# EAGLE design hub_board (EAGLE 6.4)

## Sheet 1 of 6: Power
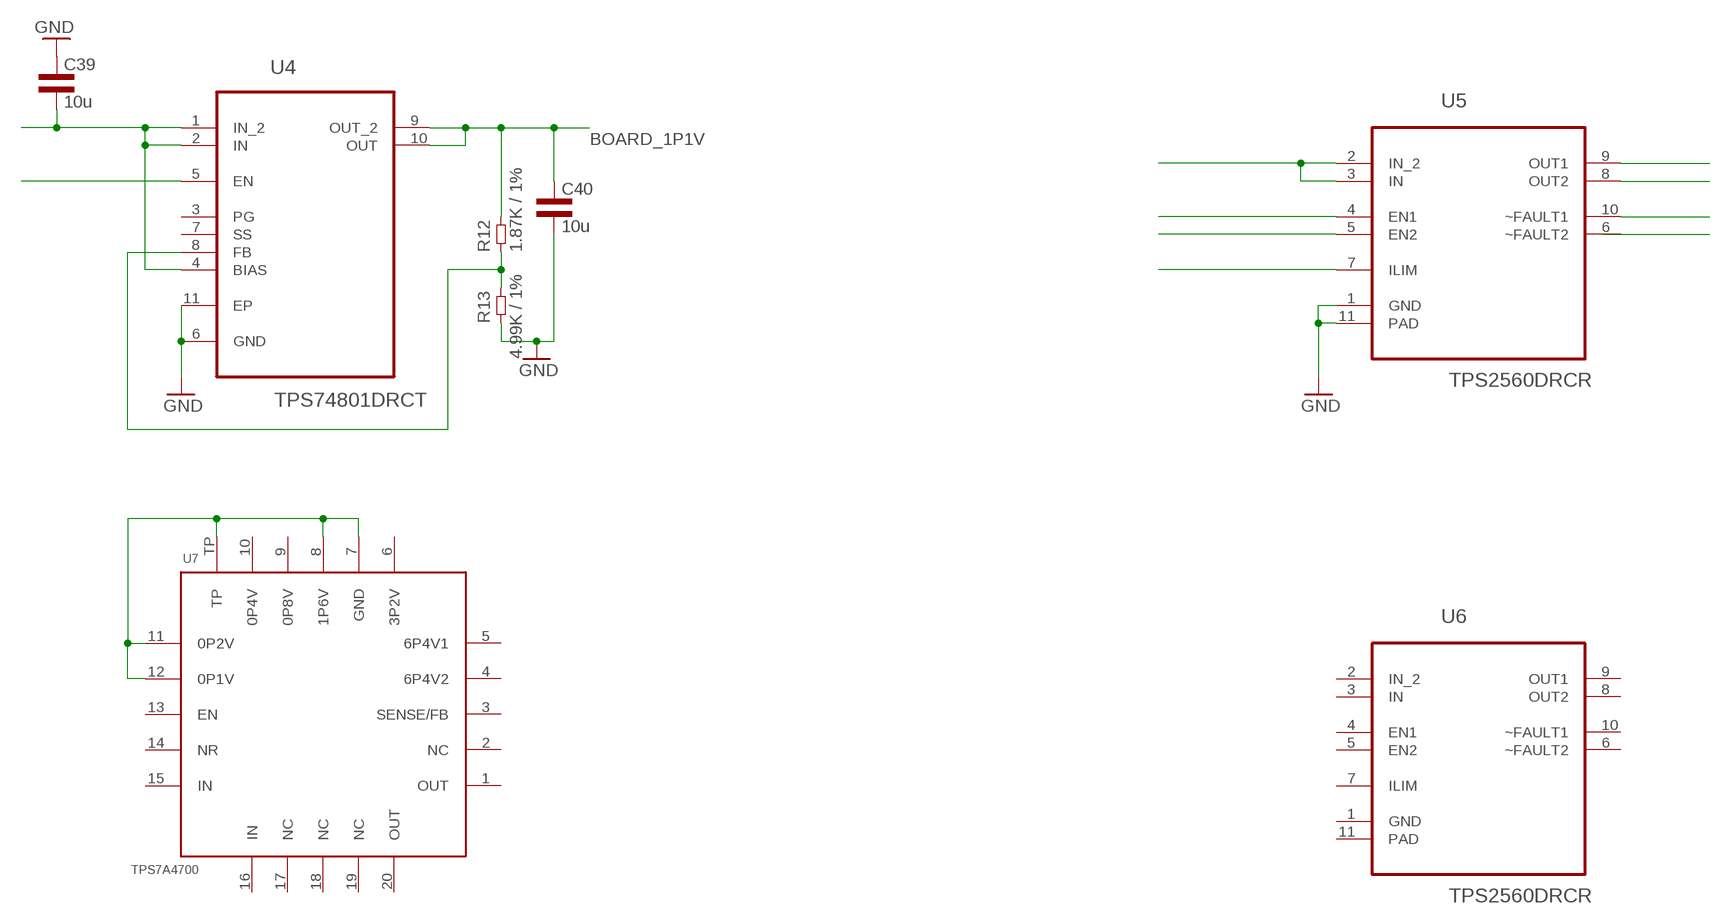
[diagram p0: schematic, sheet 1]

### Parts
C39  10u  CAP0805L3  [0805L3]
C40  10u  CAP0805L3  [0805L3]
R12  1.87K / 1%  RES0603L3  [0603L3]
R13  4.99K / 1%  RES0603L3  [0603L3]
U4  TPS74801DRCT  [SON50P300X300X100-11N]
U5  TPS2560DRCR  [SON50P300X300X100-11N]
U6  TPS2560DRCR  [SON50P300X300X100-11N]
U7  TPS7A4700  [VQFN-20]

### Nets
BOARD_1P1V: C40.1 R12.P$2 U4.9(OUT_2) U4.10(OUT)
GND: C39.1 C40.2 R13.P$1 U4.6(GND) U4.11(EP) U5.1(GND) U5.11(PAD) ; also sheet 2,4,6
N$2: C39.2 U4.1(IN_2) U4.2(IN) U4.4(BIAS)
N$3: U4.5(EN)
N$5: U5.2(IN_2) U5.3(IN)
N$6: U5.4(EN1)
N$8: R12.P$1 R13.P$2 U4.8(FB)
N$9: U5.5(EN2)
N$11: U5.7(ILIM)
N$15: U5.10(~FAULT1)
N$17: U5.9(OUT1)
N$18: U5.8(OUT2)
N$55: U7.7(GND) U7.8(1P6V) U7.11(0P2V) U7.12(0P1V) U7.TP
Unconnected: U4.3(PG) U4.7(SS) U5.6(~FAULT2) U6.1(GND) U6.4(EN1) U6.5(EN2) U6.6(~FAULT2) U6.7(ILIM) U6.8(OUT2) U6.9(OUT1) U6.10(~FAULT1) U6.11(PAD) U7.1(OUT) U7.2(NC) U7.3(SENSE/FB) U7.4(6P4V2) U7.5(6P4V1) U7.6(3P2V) U7.9(0P8V) U7.10(0P4V) U7.13(EN) U7.14(NR) U7.15(IN) U7.16(IN) U7.17(NC) U7.18(NC) U7.19(NC) U7.20(OUT)

## Sheet 2 of 6: 8040 Chip
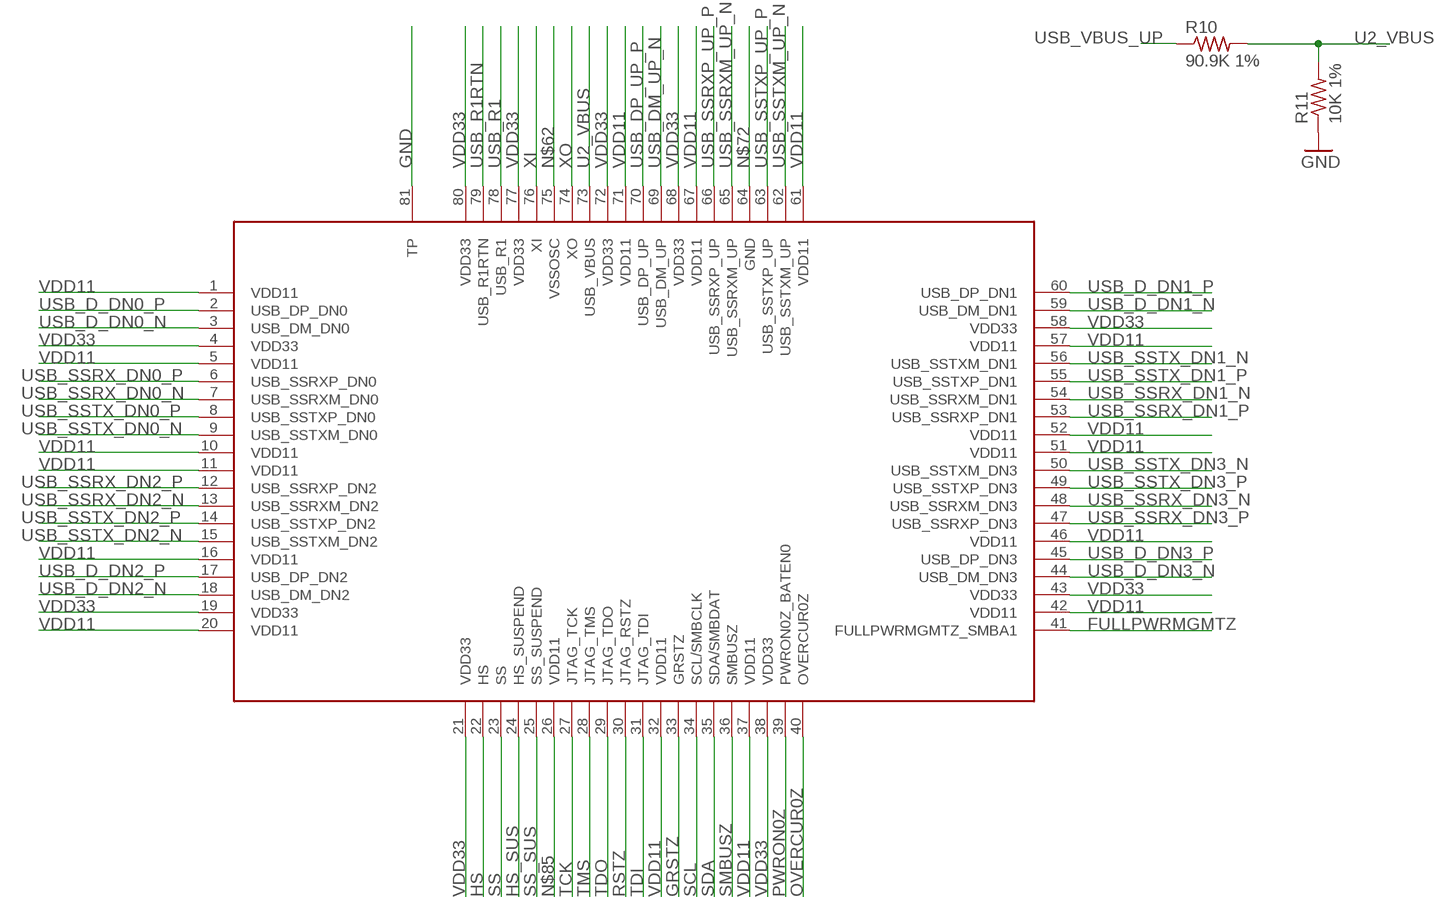
[diagram p1: schematic, sheet 2]

### Parts
R10  90.9K 1%  R-US_R0603  [R0603]
R11  10K 1%  R-US_R0603  [R0603]
U2  TUSB8040PFP  [S-PQFP-G80]

### Nets
FULLPWRMGMTZ: U2.41(FULLPWRMGMTZ_SMBA1)
GND: R11.1 U2.81(TP) ; also sheet 1,4,6
GRSTZ: U2.33(GRSTZ)
HS: U2.22(HS) ; also sheet 5
HS_SUS: U2.24(HS_SUSPEND) ; also sheet 5
N$62: U2.75(VSSOSC)
N$72: U2.64(GND)
N$85: U2.26(VDD11)
OVERCUR0Z: U2.40(OVERCUR0Z)
PWRON0Z: U2.39(PWRON0Z_BATEN0)
RSTZ: U2.30(JTAG_RSTZ)
SCL: U2.34(SCL/SMBCLK)
SDA: U2.35(SDA/SMBDAT)
SMBUSZ: U2.36(SMBUSZ)
SS: U2.23(SS) ; also sheet 5
SS_SUS: U2.25(SS_SUSPEND) ; also sheet 5
TCK: U2.27(JTAG_TCK)
TDI: U2.31(JTAG_TDI)
TDO: U2.29(JTAG_TDO)
TMS: U2.28(JTAG_TMS)
U2_VBUS: R10.2 R11.2 U2.73(USB_VBUS)
USB_D_DN0_N: U2.3(USB_DM_DN0) ; also sheet 4
USB_D_DN0_P: U2.2(USB_DP_DN0) ; also sheet 4
USB_D_DN1_N: U2.59(USB_DM_DN1) ; also sheet 4
USB_D_DN1_P: U2.60(USB_DP_DN1) ; also sheet 4
USB_D_DN2_N: U2.18(USB_DM_DN2) ; also sheet 4
USB_D_DN2_P: U2.17(USB_DP_DN2) ; also sheet 4
USB_D_DN3_N: U2.44(USB_DM_DN3) ; also sheet 4
USB_D_DN3_P: U2.45(USB_DP_DN3) ; also sheet 4
USB_DM_UP_N: U2.69(USB_DM_UP) ; also sheet 3
USB_DP_UP_P: U2.70(USB_DP_UP) ; also sheet 3
USB_R1: U2.78(USB_R1)
USB_R1RTN: U2.79(USB_R1RTN)
USB_SSRX_DN0_N: U2.7(USB_SSRXM_DN0) ; also sheet 4
USB_SSRX_DN0_P: U2.6(USB_SSRXP_DN0) ; also sheet 4
USB_SSRX_DN1_N: U2.54(USB_SSRXM_DN1) ; also sheet 4
USB_SSRX_DN1_P: U2.53(USB_SSRXP_DN1) ; also sheet 4
USB_SSRX_DN2_N: U2.13(USB_SSRXM_DN2) ; also sheet 4
USB_SSRX_DN2_P: U2.12(USB_SSRXP_DN2) ; also sheet 4
USB_SSRX_DN3_N: U2.48(USB_SSRXM_DN3) ; also sheet 4
USB_SSRX_DN3_P: U2.47(USB_SSRXP_DN3) ; also sheet 4
USB_SSRXM_UP_N: U2.65(USB_SSRXM_UP)
USB_SSRXP_UP_P: U2.66(USB_SSRXP_UP)
USB_SSTX_DN0_N: U2.9(USB_SSTXM_DN0) ; also sheet 4
USB_SSTX_DN0_P: U2.8(USB_SSTXP_DN0) ; also sheet 4
USB_SSTX_DN1_N: U2.56(USB_SSTXM_DN1) ; also sheet 4
USB_SSTX_DN1_P: U2.55(USB_SSTXP_DN1) ; also sheet 4
USB_SSTX_DN2_N: U2.15(USB_SSTXM_DN2) ; also sheet 4
USB_SSTX_DN2_P: U2.14(USB_SSTXP_DN2) ; also sheet 4
USB_SSTX_DN3_N: U2.50(USB_SSTXM_DN3) ; also sheet 4
USB_SSTX_DN3_P: U2.49(USB_SSTXP_DN3) ; also sheet 4
USB_SSTXM_UP_N: U2.62(USB_SSTXM_UP)
USB_SSTXP_UP_P: U2.63(USB_SSTXP_UP)
USB_VBUS_UP: R10.1
VDD11: U2.1(VDD11) U2.5(VDD11) U2.10(VDD11) U2.11(VDD11) U2.16(VDD11) U2.20(VDD11) U2.32(VDD11) U2.37(VDD11) U2.42(VDD11) U2.46(VDD11) U2.51(VDD11) U2.52(VDD11) U2.57(VDD11) U2.61(VDD11) U2.67(VDD11) U2.71(VDD11) ; also sheet 6
VDD33: U2.4(VDD33) U2.19(VDD33) U2.21(VDD33) U2.38(VDD33) U2.43(VDD33) U2.58(VDD33) U2.68(VDD33) U2.72(VDD33) U2.77(VDD33) U2.80(VDD33) ; also sheet 6
XI: U2.76(XI)
XO: U2.74(XO)

## Sheet 3 of 6: Upstream Port
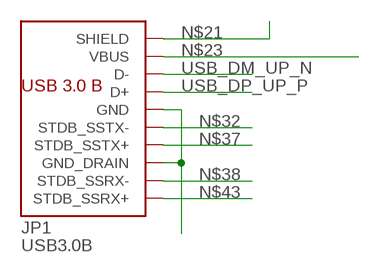
[diagram p2: schematic, sheet 3]

### Parts
JP1  USB3.0B  [AMPHENOLUSB3.0B]

### Nets
N$21: JP1.10@1(SHIELD) JP1.10@2(SHIELD)
N$23: JP1.1(VBUS)
N$24: JP1.4(GND) JP1.7(GND_DRAIN)
N$32: JP1.5(STDB_SSTX-)
N$37: JP1.6(STDB_SSTX+)
N$38: JP1.8(STDB_SSRX-)
N$43: JP1.9(STDB_SSRX+)
USB_DM_UP_N: JP1.2(D-) ; also sheet 2
USB_DP_UP_P: JP1.3(D+) ; also sheet 2

## Sheet 4 of 6: USB Ports
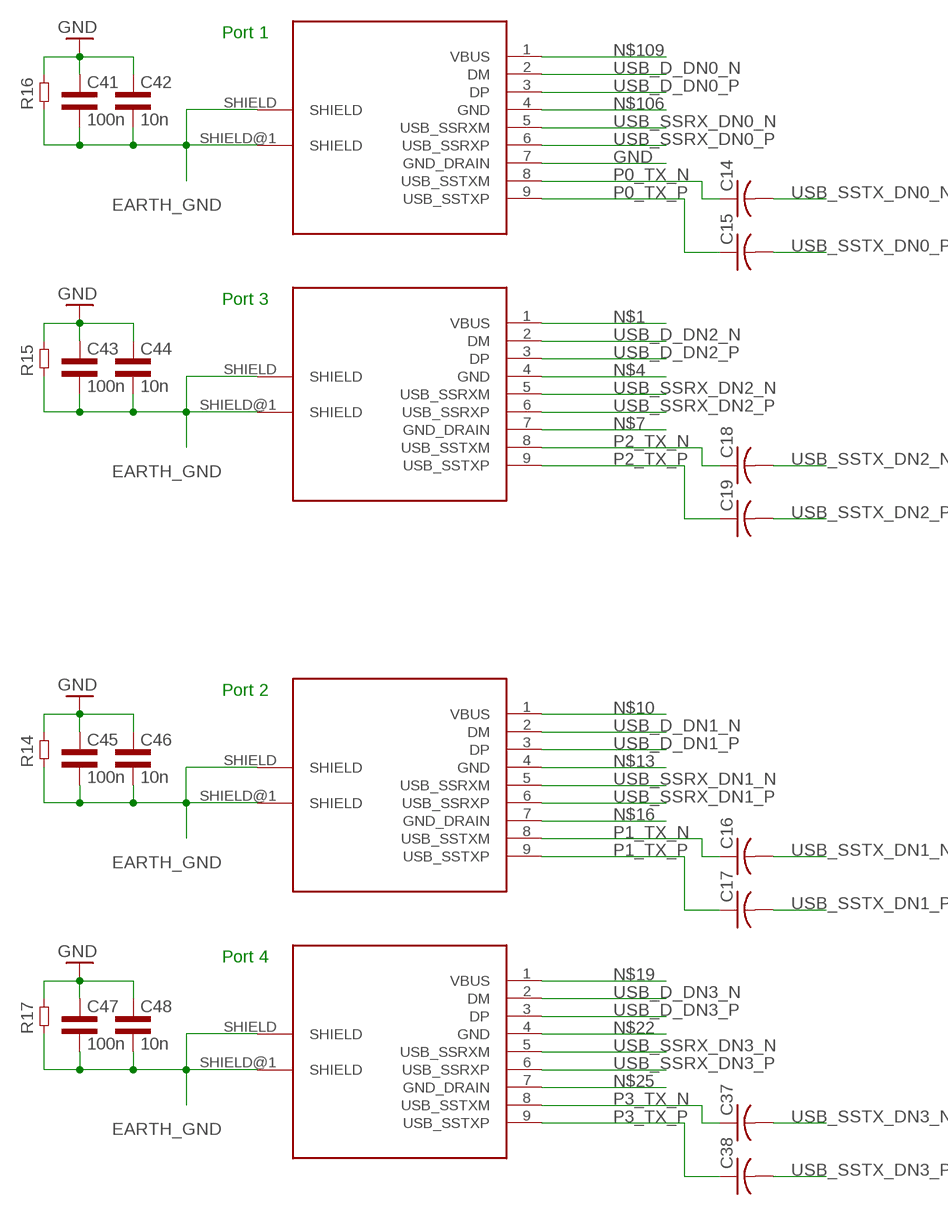
[diagram p3: schematic, sheet 4]

### Parts
C14  C-USC0201  [C0201]
C15  C-USC0201  [C0201]
C16  C-USC0201  [C0201]
C17  C-USC0201  [C0201]
C18  C-USC0201  [C0201]
C19  C-USC0201  [C0201]
C37  C-USC0201  [C0201]
C38  C-USC0201  [C0201]
C41  100n  CAP0603L3  [0603L3]
C42  10n  CAP0603L3  [0603L3]
C43  100n  CAP0603L3  [0603L3]
C44  10n  CAP0603L3  [0603L3]
C45  100n  CAP0603L3  [0603L3]
C46  10n  CAP0603L3  [0603L3]
C47  100n  CAP0603L3  [0603L3]
C48  10n  CAP0603L3  [0603L3]
R14  RES0603L3  [0603L3]
R15  RES0603L3  [0603L3]
R16  RES0603L3  [0603L3]
R17  RES0603L3  [0603L3]
U$1  USB_SS_CONN_TYPE_A  [R_A_DIP]
U$3  USB_SS_CONN_TYPE_A  [R_A_DIP]
U$4  USB_SS_CONN_TYPE_A  [R_A_DIP]
U$5  USB_SS_CONN_TYPE_A  [R_A_DIP]

### Nets
EARTH_GND: C41.P$2 C42.P$2 C43.P$2 C44.P$2 C45.P$2 C46.P$2 C47.P$2 C48.P$2 R14.P$1 R15.P$1 R16.P$1 R17.P$1 U$1.SHIELD U$1.SHIELD@1(SHIELD) U$3.SHIELD U$3.SHIELD@1(SHIELD) U$4.SHIELD U$4.SHIELD@1(SHIELD) U$5.SHIELD U$5.SHIELD@1(SHIELD)
GND: C41.P$1 C42.P$1 C43.P$1 C44.P$1 C45.P$1 C46.P$1 C47.P$1 C48.P$1 R14.P$2 R15.P$2 R16.P$2 R17.P$2 U$1.7(GND_DRAIN) ; also sheet 1,2,6
N$1: U$3.1(VBUS)
N$4: U$3.4(GND)
N$7: U$3.7(GND_DRAIN)
N$10: U$4.1(VBUS)
N$13: U$4.4(GND)
N$16: U$4.7(GND_DRAIN)
N$19: U$5.1(VBUS)
N$22: U$5.4(GND)
N$25: U$5.7(GND_DRAIN)
N$106: U$1.4(GND)
N$109: U$1.1(VBUS)
P0_TX_N: C14.1 U$1.8(USB_SSTXM)
P0_TX_P: C15.1 U$1.9(USB_SSTXP)
P1_TX_N: C16.1 U$4.8(USB_SSTXM)
P1_TX_P: C17.1 U$4.9(USB_SSTXP)
P2_TX_N: C18.1 U$3.8(USB_SSTXM)
P2_TX_P: C19.1 U$3.9(USB_SSTXP)
P3_TX_N: C37.1 U$5.8(USB_SSTXM)
P3_TX_P: C38.1 U$5.9(USB_SSTXP)
USB_D_DN0_N: U$1.2(DM) ; also sheet 2
USB_D_DN0_P: U$1.3(DP) ; also sheet 2
USB_D_DN1_N: U$4.2(DM) ; also sheet 2
USB_D_DN1_P: U$4.3(DP) ; also sheet 2
USB_D_DN2_N: U$3.2(DM) ; also sheet 2
USB_D_DN2_P: U$3.3(DP) ; also sheet 2
USB_D_DN3_N: U$5.2(DM) ; also sheet 2
USB_D_DN3_P: U$5.3(DP) ; also sheet 2
USB_SSRX_DN0_N: U$1.5(USB_SSRXM) ; also sheet 2
USB_SSRX_DN0_P: U$1.6(USB_SSRXP) ; also sheet 2
USB_SSRX_DN1_N: U$4.5(USB_SSRXM) ; also sheet 2
USB_SSRX_DN1_P: U$4.6(USB_SSRXP) ; also sheet 2
USB_SSRX_DN2_N: U$3.5(USB_SSRXM) ; also sheet 2
USB_SSRX_DN2_P: U$3.6(USB_SSRXP) ; also sheet 2
USB_SSRX_DN3_N: U$5.5(USB_SSRXM) ; also sheet 2
USB_SSRX_DN3_P: U$5.6(USB_SSRXP) ; also sheet 2
USB_SSTX_DN0_N: C14.2 ; also sheet 2
USB_SSTX_DN0_P: C15.2 ; also sheet 2
USB_SSTX_DN1_N: C16.2 ; also sheet 2
USB_SSTX_DN1_P: C17.2 ; also sheet 2
USB_SSTX_DN2_N: C18.2 ; also sheet 2
USB_SSTX_DN2_P: C19.2 ; also sheet 2
USB_SSTX_DN3_N: C37.2 ; also sheet 2
USB_SSTX_DN3_P: C38.2 ; also sheet 2

### Notes on the sheet
- Port 1
- Port 3
- Port 2
- Port 4

## Sheet 5 of 6: Indicators
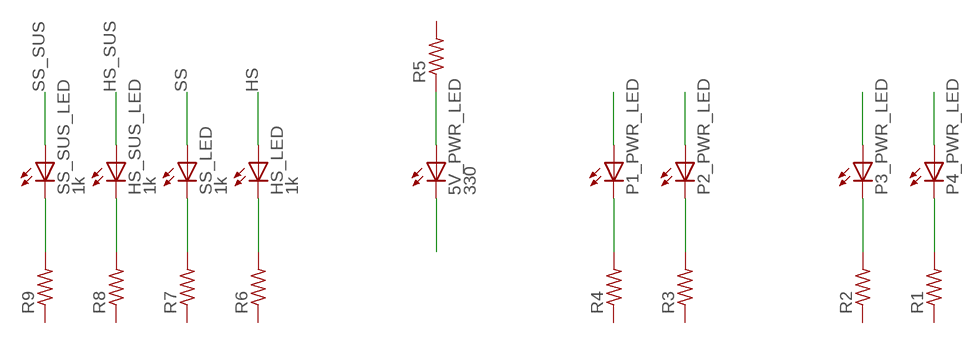
[diagram p4: schematic, sheet 5]

### Parts
5V_PWR_LED  330  LEDCHIP-LED0603  [CHIP-LED0603]
HS_LED  1k  LEDCHIP-LED0603  [CHIP-LED0603]
HS_SUS_LED  1k  LEDCHIP-LED0603  [CHIP-LED0603]
P1_PWR_LED  LEDCHIP-LED0603  [CHIP-LED0603]
P2_PWR_LED  LEDCHIP-LED0603  [CHIP-LED0603]
P3_PWR_LED  LEDCHIP-LED0603  [CHIP-LED0603]
P4_PWR_LED  LEDCHIP-LED0603  [CHIP-LED0603]
R1  R-US_R0603  [R0603]
R2  R-US_R0603  [R0603]
R3  R-US_R0603  [R0603]
R4  R-US_R0603  [R0603]
R5  R-US_R0603  [R0603]
R6  R-US_R0603  [R0603]
R7  R-US_R0603  [R0603]
R8  R-US_R0603  [R0603]
R9  R-US_R0603  [R0603]
SS_LED  1k  LEDCHIP-LED0603  [CHIP-LED0603]
SS_SUS_LED  1k  LEDCHIP-LED0603  [CHIP-LED0603]

### Nets
HS: HS_LED.A ; also sheet 2
HS_SUS: HS_SUS_LED.A ; also sheet 2
N$33: 5V_PWR_LED.A R5.1
N$34: P1_PWR_LED.A
N$35: P2_PWR_LED.A
N$36: P3_PWR_LED.A
N$39: P4_PWR_LED.A
N$40: P4_PWR_LED.C R1.2
N$41: P3_PWR_LED.C R2.2
N$42: P2_PWR_LED.C R3.2
N$46: 5V_PWR_LED.C
N$47: HS_LED.C R6.2
N$48: R7.2 SS_LED.C
N$50: HS_SUS_LED.C R8.2
N$51: R9.2 SS_SUS_LED.C
N$100: P1_PWR_LED.C R4.2
SS: SS_LED.A ; also sheet 2
SS_SUS: SS_SUS_LED.A ; also sheet 2
Unconnected: R1.1 R2.1 R3.1 R4.1 R5.2 R6.1 R7.1 R8.1 R9.1

## Sheet 6 of 6: Bypass Caps
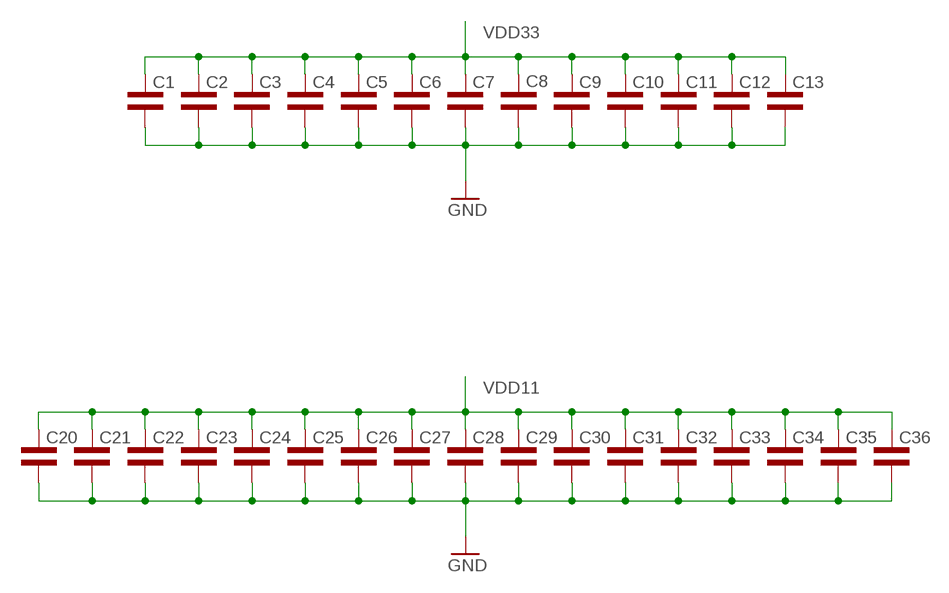
[diagram p5: schematic, sheet 6]

### Parts
C1  CAP0402L3  [0402L3]
C2  CAP0402L3  [0402L3]
C3  CAP0402L3  [0402L3]
C4  CAP0402L3  [0402L3]
C5  CAP0402L3  [0402L3]
C6  CAP0402L3  [0402L3]
C7  CAP0402L3  [0402L3]
C8  CAP0402L3  [0402L3]
C9  CAP0402L3  [0402L3]
C10  CAP0402L3  [0402L3]
C11  CAP0402L3  [0402L3]
C12  CAP0402L3  [0402L3]
C13  CAP0402L3  [0402L3]
C20  CAP0402L3  [0402L3]
C21  CAP0402L3  [0402L3]
C22  CAP0402L3  [0402L3]
C23  CAP0402L3  [0402L3]
C24  CAP0402L3  [0402L3]
C25  CAP0402L3  [0402L3]
C26  CAP0402L3  [0402L3]
C27  CAP0402L3  [0402L3]
C28  CAP0402L3  [0402L3]
C29  CAP0402L3  [0402L3]
C30  CAP0402L3  [0402L3]
C31  CAP0402L3  [0402L3]
C32  CAP0402L3  [0402L3]
C33  CAP0402L3  [0402L3]
C34  CAP0402L3  [0402L3]
C35  CAP0402L3  [0402L3]
C36  CAP0402L3  [0402L3]

### Nets
GND: C1.P$2 C2.P$2 C3.P$2 C4.P$2 C5.P$2 C6.P$2 C7.P$2 C8.P$2 C9.P$2 C10.P$2 C11.P$2 C12.P$2 C13.P$2 C20.P$2 C21.P$2 C22.P$2 C23.P$2 C24.P$2 C25.P$2 C26.P$2 C27.P$2 C28.P$2 C29.P$2 C30.P$2 C31.P$2 C32.P$2 C33.P$2 C34.P$2 C35.P$2 C36.P$2 ; also sheet 1,2,4
VDD11: C20.P$1 C21.P$1 C22.P$1 C23.P$1 C24.P$1 C25.P$1 C26.P$1 C27.P$1 C28.P$1 C29.P$1 C30.P$1 C31.P$1 C32.P$1 C33.P$1 C34.P$1 C35.P$1 C36.P$1 ; also sheet 2
VDD33: C1.P$1 C2.P$1 C3.P$1 C4.P$1 C5.P$1 C6.P$1 C7.P$1 C8.P$1 C9.P$1 C10.P$1 C11.P$1 C12.P$1 C13.P$1 ; also sheet 2

## Power pins joined to a net without a drawn wire
IN: U6.3(IN)
IN_2: U6.2(IN_2)

## Library data of the parts
5V_PWR_LED HS_LED HS_SUS_LED P1_PWR_LED P2_PWR_LED P3_PWR_LED P4_PWR_LED SS_LED SS_SUS_LED = adafruit:LED: LED OSRAM: - CHIPLED LG R971, LG N971, LY N971, LG Q971, LY Q971, LO R971, LY R971 LH N974, LH R974 LS Q976, LO Q976, LY Q976 LO Q996 - Hyper CHIPLED LW Q18S LB Q993, LB Q99A, LB R99A - SideLED LS A670, LO A670, LY A670, LG A670, LP A670 LB A673, LV A673, LT A673, LW A673 LH A674 LY A675 LS A676, LA A676, LO A676, LY A676, LW A676 LS A679, LY A679, LG A679 - Hyper Micro SIDELED® LS Y876, LA Y876, LO Y876, LY Y876 LT Y87S - SmartLED LW L88C, LW L88S LB L89C, LB L89S, LG L890 LS L89K, LO L89K, LY L89K LS L896, LA L896, LO L896, LY L896 - TOPLED LS T670, LO T670, LY T670, LG T670, LP T670 LSG T670, LSP T670, LSY T670, LOP T670, LYG T670 LG T671, LOG T671, LSG T671 LB T673, LV T673, LT T673, LW T673 LH T674 LS T676, LA T676, LO T676, LY T676, LB T676, LH T676, LSB T676, LW T676 LB T67C, LV T67C, LT T67C, LS T67K, LO T67K, LY T67K, LW E67C LS E67B, LA E67B, LO E67B, LY E67B, LB E67C, LV E67C, LT E67C LW T67C LS T679, LY T679, LG T679 LS T770, LO T770, LY T770, LG T770, LP T770 LB T773, LV T773, LT T773, LW T773 LH T774 LS E675, LA E675, LY E675, LS T675 LS T776, LA T776, LO T776, LY T776, LB T776 LHGB T686 LT T68C, LB T68C - Hyper Mini TOPLED® LB M676 - Mini TOPLED Santana® LG M470 LS M47K, LO M47K, LY M47K Source: http://www.osram.convergy.de/
C1-C13 C20-C36 C39-C48 = common:CAP
C14-C19 C37 C38 = rcl:C-US: CAPACITOR, American symbol
JP1 = AlexW-Eagle-Libraries:USB3.0B: USB3.0B Amphenol USB 3.0 B connector
R1-R11 = rcl:R-US_: RESISTOR, American symbol
R12-R17 = common:RES
U2 = tusb8040a1:TUSB8040PFP: TUSB8040 is a 4-port SuperSPeed USB 3.0 hub.
U4 = Texas Instruments_By_element14_Batch_1:TPS74801DRCT: Linear Regulator with Programmable Soft-Start; MPN: TPS74801DRCT; OC_FARNELL: 1755498; OC_NEWARK: 30M1869; PACKAGE: SON-10; SUPPLIER: TEXAS INSTRUMENTS
U5 U6 = Texas Instruments_By_element14_Batch_1:TPS2560DRCR: DUAL CHANNEL PRECISION ADJUSTABLE CURRENT-LIMITED POWER SWITCHES; MPN: TPS2560DRCR; OC_FARNELL: -; OC_NEWARK: 64R0736; PACKAGE: SON-10; SUPPLIER: TEXAS INSTRUMENTS
U7 = ti_ldo:TPS7A4700: Ultra-Low Noise POSITIVE Voltage Regulator
U$1 U$3-U$5 = usb3_type_a:USB_SS_CONN_TYPE_A: USB 3 SuperSpeed Type A connector, through hole design.

## Board
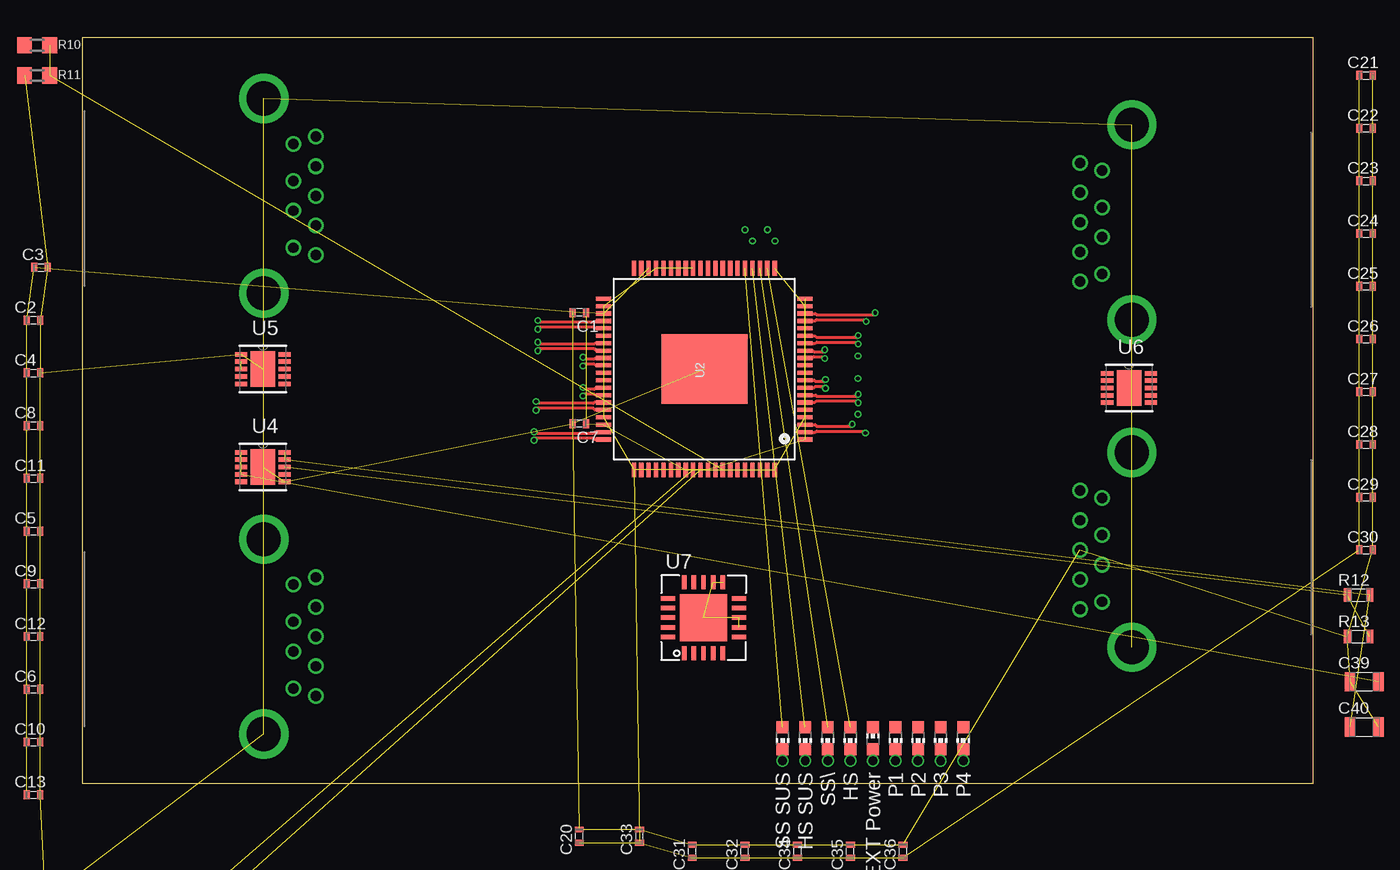
[diagram p6: board, top side]
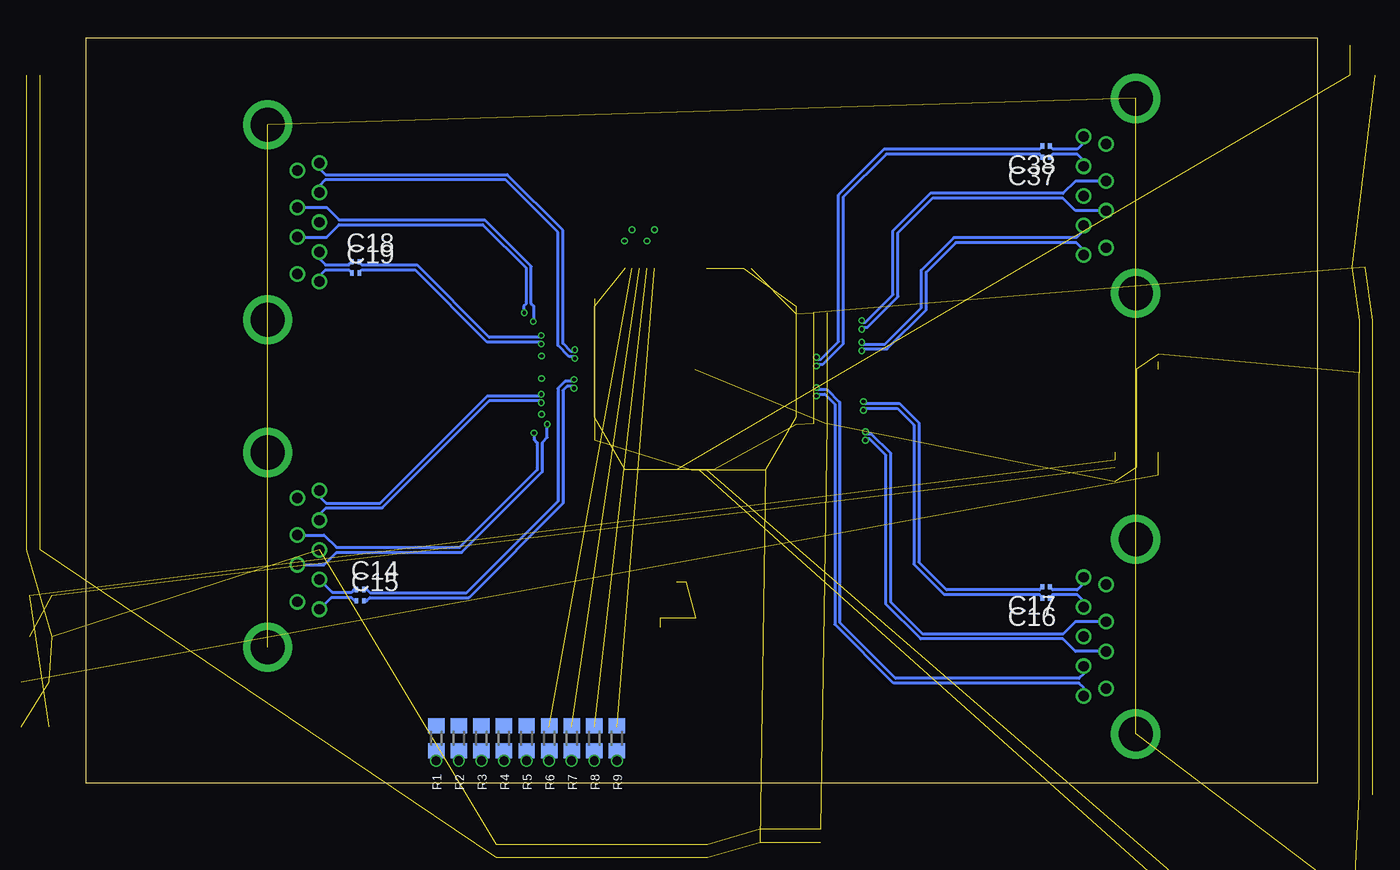
[diagram p7: board, bottom side, seen from below]

Size 83.04 x 50.29 mm. Coordinates in mm from the lower left corner, seen from the top.
Outline: 0,0 83.04,0 83.04,50.29 0,50.29 0,0
Copper layers (1*2*3*16): Top 0.035mm / dielectric 1.5mm / Route2 0.035mm / dielectric 0.15mm / Route3 0.035mm / dielectric 0.2mm / Bottom 0.035mm
Design rules "default *": minimum track width 5mil, minimum drill 10mil, track to track 5mil, track to pad 5mil, pad to pad 5mil, via to via 5mil, smd to smd 5mil, copper to edge 13mil, drill to drill 8mil, minimum pad ring 4mil, minimum via ring 4mil, stop-mask expansion 2mil, vias tented up to drill 0mil, thermal gap 10mil

### Footprints (pad centres in the part's own frame; a part is rotated, then mirrored left to right if it is on the bottom)
CHIP-LED0603 = smd 0.8 x 0.8: A 0,-0.75; C 0,0.75
0402L3 = smd 0.4 x 0.6: P$1 -0.45,0; P$2 0.45,0
C0201 = smd 0.25 x 0.35: 1 -0.25,0; 2 0.25,0
0805L3 = smd 0.7 x 1.3: 1 -0.95,0; 2 0.95,0
0603L3 = smd 0.5 x 0.9: P$1 -0.75,0; P$2 0.75,0
AMPHENOLUSB3.0B = drill 0.92 square: 1 1.25,4.71; 2 -1.25,4.71; 3 -1.25,2.71; 4 1.25,2.71 | drill 0.7 square: 5 -4.5,6.71; 6 -2.75,6.71; 7 0,6.71; 8 2.75,6.71; 9 4.5,6.71 | drill 2.3 square: 10@1 -6.02,0; 10@2 6.02,0
R0603 = smd 1 x 1.1: 1 -0.85,0; 2 0.85,0
S-PQFP-G80 = smd 0.28 x 1: 1 -4.75,-6.8; 2 -4.25,-6.8; 3 -3.75,-6.8; 4 -3.25,-6.8; 5 -2.75,-6.8; 6 -2.25,-6.8; 7 -1.75,-6.8; 8 -1.25,-6.8; 9 -0.75,-6.8; 10 -0.25,-6.8; 11 0.25,-6.8; 12 0.75,-6.8; 13 1.25,-6.8; 14 1.75,-6.8; 15 2.25,-6.8; 16 2.75,-6.8; 17 3.25,-6.8; 18 3.75,-6.8; 19 4.25,-6.8; 20 4.75,-6.8; 41 4.75,6.8; 42 4.25,6.8; 43 3.75,6.8; 44 3.25,6.8; 45 2.75,6.8; 46 2.25,6.8; 47 1.75,6.8; 48 1.25,6.8; 49 0.75,6.8; 50 0.25,6.8; 51 -0.25,6.8; 52 -0.75,6.8; 53 -1.25,6.8; 54 -1.75,6.8; 55 -2.25,6.8; 56 -2.75,6.8; 57 -3.25,6.8; 58 -3.75,6.8; 59 -4.25,6.8; 60 -4.75,6.8 | smd 1 x 0.28: 21 6.8,-4.75; 22 6.8,-4.25; 23 6.8,-3.75; 24 6.8,-3.25; 25 6.8,-2.75; 26 6.8,-2.25; 27 6.8,-1.75; 28 6.8,-1.25; 29 6.8,-0.75; 30 6.8,-0.25; 31 6.8,0.25; 32 6.8,0.75; 33 6.8,1.25; 34 6.8,1.75; 35 6.8,2.25; 36 6.8,2.75; 37 6.8,3.25; 38 6.8,3.75; 39 6.8,4.25; 40 6.8,4.75; 61 -6.8,4.75; 62 -6.8,4.25; 63 -6.8,3.75; 64 -6.8,3.25; 65 -6.8,2.75; 66 -6.8,2.25; 67 -6.8,1.75; 68 -6.8,1.25; 69 -6.8,0.75; 70 -6.8,0.25; 71 -6.8,-0.25; 72 -6.8,-0.75; 73 -6.8,-1.25; 74 -6.8,-1.75; 75 -6.8,-2.25; 76 -6.8,-2.75; 77 -6.8,-3.25; 78 -6.8,-3.75; 79 -6.8,-4.25; 80 -6.8,-4.75 | smd 4.7 x 5.8: 81 0,0
SON50P300X300X100-11N = smd 0.813 x 0.305: 1 -1.473,0.991; 2 -1.473,0.508; 3 -1.473,0; 4 -1.473,-0.508; 5 -1.473,-0.991; 6 1.473,-0.991; 7 1.473,-0.508; 8 1.473,0; 9 1.473,0.508; 10 1.473,0.991 | smd 1.651 x 2.388: 11 0,0
VQFN-20 = smd 0.3 x 0.95: 1 -1.3,-2.4; 2 -0.65,-2.4; 3 0,-2.4; 4 0.65,-2.4; 5 1.3,-2.4; 11 1.3,2.4; 12 0.65,2.4; 13 0,2.4; 14 -0.65,2.4; 15 -1.3,2.4 | smd 0.95 x 0.3: 6 2.4,-1.3; 7 2.4,-0.65; 8 2.4,0; 9 2.4,0.65; 10 2.4,1.3; 16 -2.4,1.3; 17 -2.4,0.65; 18 -2.4,0; 19 -2.4,-0.65; 20 -2.4,-1.3 | smd 3.15 x 3.15: TP 0,0
R_A_DIP = drill 0.7: 1 -1.5,3.5; 2 -1.5,1; 3 -1.5,-1; 4 -1.5,-3.5; 5 0,-4; 6 0,-2; 7 0,0; 8 0,2; 9 0,4 | drill 2.3: SHIELD -3.5,6.57; SHIELD@1 -3.5,-6.57

### Placement (x,y rotation side)
5V_PWR_LED  53.34,3.05 0 top
C1  33.53,31.75 180 top
C2  -3.3,31.24 0 top
C3  -2.79,34.8 0 top
C4  -3.3,27.69 0 top
C5  -3.3,17.02 0 top
C6  -3.3,6.35 0 top
C7  33.53,24.26 180 top
C8  -3.3,24.13 0 top
C9  -3.3,13.46 0 top
C10  -3.3,2.79 0 top
C11  -3.3,20.57 0 top
C12  -3.3,9.91 0 top
C13  -3.3,-0.76 0 top
C14  64.57,13.08 0 bottom
C15  64.57,12.32 0 bottom
C16  18.29,12.51 180 bottom
C17  18.29,13.27 180 bottom
C18  64.87,35.18 0 bottom
C19  64.87,34.42 0 bottom
C20  33.53,-3.56 90 top  (outside the outline)
C21  86.61,47.75 0 top  (outside the outline)
C22  86.61,44.2 0 top  (outside the outline)
C23  86.61,40.64 0 top  (outside the outline)
C24  86.61,37.08 0 top  (outside the outline)
C25  86.61,33.53 0 top  (outside the outline)
C26  86.61,29.97 0 top  (outside the outline)
C27  86.61,26.42 0 top  (outside the outline)
C28  86.61,22.86 0 top  (outside the outline)
C29  86.61,19.3 0 top  (outside the outline)
C30  86.61,15.75 0 top  (outside the outline)
C31  41.15,-4.57 90 top  (outside the outline)
C32  44.7,-4.57 90 top  (outside the outline)
C33  37.59,-3.56 90 top  (outside the outline)
C34  48.26,-4.57 90 top  (outside the outline)
C35  51.82,-4.57 90 top  (outside the outline)
C36  55.37,-4.57 90 top  (outside the outline)
C37  18.29,42.23 180 bottom
C38  18.29,42.99 180 bottom
C39  86.49,6.86 0 top
C40  86.49,3.81 0 top
C41  -3.17,-20.07 0 top  (outside the outline)
C42  -3.17,-22.86 0 top  (outside the outline)
C43  -3.17,-25.65 0 top  (outside the outline)
C44  -3.17,-28.45 0 top  (outside the outline)
C45  -3.17,-31.24 0 top  (outside the outline)
C46  -3.17,-34.04 0 top  (outside the outline)
C47  -3.17,-36.83 0 top  (outside the outline)
C48  -3.17,-39.62 0 top  (outside the outline)
HS_LED  51.82,3.05 180 top
HS_SUS_LED  48.77,3.05 180 top
JP1  -12.95,-31.5 0 top  (outside the outline)
P1_PWR_LED  54.86,3.05 180 top
P2_PWR_LED  56.39,3.05 180 top
P3_PWR_LED  57.91,3.05 180 top
P4_PWR_LED  59.44,3.05 180 top
R1  59.44,3.05 270 bottom
R2  57.91,3.05 270 bottom
R3  56.39,3.05 270 bottom
R4  54.86,3.05 270 bottom
R5  53.34,3.05 90 bottom
R6  51.82,3.05 270 bottom
R7  50.29,3.05 270 bottom
R8  48.77,3.05 270 bottom
R9  47.24,3.05 270 bottom
R10  -3.05,49.78 0 top
R11  -3.05,47.75 0 top
R12  86.11,12.7 0 top
R13  86.11,9.91 0 top
R14  -3.17,-8.89 0 top  (outside the outline)
R15  -3.17,-11.68 0 top  (outside the outline)
R16  -3.17,-14.48 0 top  (outside the outline)
R17  -3.17,-17.27 0 top  (outside the outline)
SS_LED  50.29,3.05 180 top
SS_SUS_LED  47.24,3.05 180 top
U2  41.96,27.94 90 top
U4  12.19,21.34 0 top
U5  12.19,27.94 0 top
U6  70.61,26.67 0 top
U7  41.91,11.18 0 top
U$1  67.31,15.75 180 top
U$3  67.31,37.85 180 top
U$4  15.75,9.91 0 top
U$5  15.75,39.62 0 top

### Tracks (layer width: path | path; a pad name or v marks a point on that pad's centre or on a via)
BOARD_1P1V  (3 unrouted)
EARTH_GND  (19 unrouted)
GND  (51 unrouted)
HS  (1 unrouted)
HS_SUS  (1 unrouted)
N$2  (3 unrouted)
N$5  (1 unrouted)
N$8  (2 unrouted)
N$12  (via drill 0.25)
  other vias: 52.32,28.83
N$14  (via drill 0.25)
  other vias: 52.32,24.89
N$20  (via drill 0.25)
  other vias: 52.32,27.3
N$21  (1 unrouted)
N$24  (1 unrouted)
N$28  (via drill 0.25)
  other vias: 46.74,36.58
N$29  (via drill 0.25)
  other vias: 46.23,37.34
N$30  (via drill 0.25)
  other vias: 45.21,36.58
N$31  (via drill 0.25)
  other vias: 44.7,37.34
N$33  (via drill 0.6)
  Top 0.406: 5V_PWR_LED.A v53.34,1.52
  Bottom 0.406: R5.1 v53.34,1.52
N$40  (via drill 0.6)
  Top 0.406: P4_PWR_LED.C v59.44,1.52
  Bottom 0.406: R1.2 v59.44,1.52
N$41  (via drill 0.6)
  Top 0.406: P3_PWR_LED.C v57.91,1.52
  Bottom 0.406: R2.2 v57.91,1.52
N$42  (via drill 0.6)
  Top 0.406: P2_PWR_LED.C v56.39,1.52
  Bottom 0.406: R3.2 v56.39,1.52
N$47  (via drill 0.6)
  Top 0.406: HS_LED.C v51.82,1.52
  Bottom 0.406: R6.2 v51.82,1.52
N$48  (via drill 0.6)
  Top 0.406: SS_LED.C v50.29,1.52
  Bottom 0.406: R7.2 v50.29,1.52
N$50  (via drill 0.6)
  Top 0.406: HS_SUS_LED.C v48.77,1.52
  Bottom 0.406: R8.2 v48.77,1.52
N$51  (via drill 0.6)
  Top 0.406: SS_SUS_LED.C v47.24,1.52
  Bottom 0.406: R9.2 v47.24,1.52
N$55  (4 unrouted)
N$100  (via drill 0.6)
  Top 0.406: P1_PWR_LED.C v54.86,1.52
  Bottom 0.406: R4.2 v54.86,1.52
P0_TX_N
  Bottom 0.203: C14.1 64.94,13.08 65.15,12.86 66.43,12.86 U$1.8
P0_TX_P
  Bottom 0.203: C15.1 64.94,12.32 65.15,12.53 66.52,12.53 U$1.9
P1_TX_N
  Bottom 0.203: C16.1 18.04,12.53 17.84,12.72 16.19,12.72 15.75,12.28 U$4.8
P1_TX_P
  Bottom 0.203: C17.1 18.04,13.25 17.84,13.06 16.19,13.06 15.75,13.5 U$4.9
P2_TX_N
  Bottom 0.203: U$3.8 67.31,35.37 66.9,34.96 65.34,34.96 C18.1
P2_TX_P
  Bottom 0.203: U$3.9 67.31,34.23 66.9,34.63 65.34,34.63 C19.1
P3_TX_N
  Bottom 0.203: C37.1 18.04,42.25 17.84,42.44 16.19,42.44 15.75,42 U$5.8
P3_TX_P
  Bottom 0.203: C38.1 18.04,42.97 17.84,42.77 16.19,42.77 15.75,43.22 U$5.9
SS  (1 unrouted)
SS_SUS  (1 unrouted)
U2_VBUS  (2 unrouted)
USB_D_DN0_N  (via drill 0.25)
  Top 0.203: U2.3 49.43,24.19 49.53,24.09 51.94,24.09 v51.94,24.22
  Bottom 0.203: v51.94,24.22 51.94,23.33 52.29,22.99 52.29,21.01 57.72,15.58 66.17,15.58 67,14.75 U$1.2
USB_D_DN0_P  (via drill 0.25)
  Top 0.203: U2.2 49.46,23.69 49.53,23.76 52.83,23.76 v52.83,23.63
  Bottom 0.203: v52.83,23.63 52.83,23.2 52.62,22.99 52.62,21.15 57.85,15.91 66.17,15.91 67,16.75 U$1.3
USB_D_DN1_N  (via drill 0.25)
  Top 0.203: U2.59 34.57,23.69 34.48,23.6 30.48,23.6 v30.48,23.72
  Bottom 0.203: v30.48,23.72 30.48,23.6 30.09,23.6 28.79,22.29 28.79,12.26 26.6,10.07 17.14,10.07 16.31,10.91 U$4.2
USB_D_DN1_P  (via drill 0.25)
  Top 0.203: U2.60 34.56,23.19 34.48,23.27 30.48,23.27 v30.48,23.14
  Bottom 0.203: v30.48,23.14 30.48,23.27 30.23,23.27 29.12,22.16 29.12,12.12 26.74,9.74 17.14,9.74 16.31,8.91 U$4.3
USB_D_DN2_N  (via drill 0.25)
  Top 0.203: U2.18 49.45,31.69 49.53,31.61 53.49,31.61 v53.49,31.74
  Bottom 0.203: v53.49,31.74 53.49,32.22 53.35,32.36 53.35,34.73 56.3,37.68 65.99,37.68 66.82,36.85 U$3.2
USB_D_DN2_P  (via drill 0.25)
  Top 0.203: U2.17 49.44,31.19 49.53,31.28 52.88,31.28 v52.88,31.15
  Bottom 0.203: v52.88,31.15 52.88,32.22 53.02,32.36 53.02,34.87 56.17,38.01 65.99,38.01 66.82,38.85 U$3.3
USB_D_DN3_N  (via drill 0.25)
  Top 0.203: U2.44 34.64,31.19 34.54,31.09 30.73,31.09 v30.73,31.22
  Bottom 0.203: U$5.2 16.31,40.62 17.14,39.79 26.1,39.79 28.61,37.28 28.61,32.96 30.49,31.09 30.73,31.09 v30.73,31.22
USB_D_DN3_P  (via drill 0.25)
  Top 0.203: U2.45 34.61,30.69 34.54,30.76 30.73,30.76 v30.73,30.63
  Bottom 0.203: U$5.3 16.31,38.62 17.14,39.46 25.97,39.46 28.28,37.14 28.28,32.83 30.35,30.76 30.73,30.76 v30.73,30.63
USB_DM_UP_N  (1 unrouted)
USB_DP_UP_P  (1 unrouted)
USB_SSRX_DN0_N  (via drill 0.25)
  Top 0.203: U2.7 49.46,26.19 49.53,26.12 52.35,26.12 v52.35,26.25
  Bottom 0.203: v52.35,26.25 52.35,26.12 56,26.12 63.21,18.91 66.88,18.91 67.31,19.34 U$1.5
USB_SSRX_DN0_P  (via drill 0.25)
  Top 0.203: U2.6 49.43,25.69 49.53,25.79 52.35,25.79 v52.35,25.67
  Bottom 0.203: v52.35,25.67 52.35,25.79 55.86,25.79 63.08,18.58 66.88,18.58 67.31,18.15 U$1.6
USB_SSRX_DN1_N  (via drill 0.25)
  Top 0.203: U2.54 34.61,26.19 34.54,26.25 33.78,26.25 v33.78,26.12
  Bottom 0.203: v33.78,26.12 33.78,26.25 33.22,26.25 32.55,25.59 32.55,10.73 28.58,6.76 16.07,6.76 15.75,6.44 U$4.5
USB_SSRX_DN1_P  (via drill 0.25)
  Top 0.203: U2.53 34.65,26.69 34.54,26.58 33.78,26.58 v33.78,26.71
  Bottom 0.203: v33.78,26.71 33.78,26.58 33.08,26.58 32.22,25.72 32.22,10.86 28.44,7.09 16.07,7.09 15.75,7.4 U$4.6
USB_SSRX_DN2_N  (via drill 0.25)
  Top 0.203: U2.13 49.28,29.19 49.35,29.12 50.09,29.12 v50.09,29.25
  Bottom 0.203: v50.09,29.25 50.09,29.12 50.33,29.12 50.89,29.69 50.89,37.3 54.64,41.06 66.9,41.06 67.31,41.47 U$3.5
USB_SSRX_DN2_P  (via drill 0.25)
  Top 0.203: U2.12 49.25,28.69 49.35,28.79 50.09,28.79 v50.09,28.66
  Bottom 0.203: v50.09,28.66 50.09,28.79 50.46,28.79 51.22,29.55 51.22,37.17 54.78,40.73 66.9,40.73 67.31,40.32 U$3.6
USB_SSRX_DN3_N  (via drill 0.25)
  Top 0.203: U2.48 34.65,29.19 34.54,29.3 30.73,29.3 v30.73,29.17
  Bottom 0.203: v30.73,29.17 30.73,29.3 29.01,29.3 26.38,31.94 26.38,34.48 24.38,36.47 16.26,36.47 15.75,35.97 U$5.5
USB_SSRX_DN3_P  (via drill 0.25)
  Top 0.203: U2.47 34.61,29.69 34.54,29.63 30.73,29.63 v30.73,29.76
  Bottom 0.203: v30.73,29.76 30.73,29.63 29.15,29.63 26.71,32.07 26.71,34.61 24.52,36.8 16.26,36.8 15.75,37.31 U$5.6
USB_SSTX_DN0_N  (via drill 0.25)
  Top 0.203: U2.9 49.38,27.19 49.45,27.11 50.14,27.11 v50.14,27.24
  Bottom 0.203: v50.14,27.24 50.14,27.11 50.74,27.11 51.22,26.64 51.22,19.02 57.37,12.86 63.91,12.86 64.12,13.08 C14.2
USB_SSTX_DN0_P  (via drill 0.25)
  Top 0.203: U2.8 49.36,26.69 49.45,26.78 50.14,26.78 v50.14,26.66
  Bottom 0.203: v50.14,26.66 50.14,26.78 50.61,26.78 50.89,26.5 50.89,18.88 57.23,12.53 63.91,12.53 64.12,12.32 C15.2
USB_SSTX_DN1_N  (via drill 0.25)
  Top 0.203: U2.56 34.59,25.19 34.48,25.3 30.61,25.3 v30.61,25.17
  Bottom 0.203: v30.61,25.17 30.61,25.3 28.33,25.3 27.22,24.19 27.22,14.79 25.15,12.72 18.73,12.72 18.54,12.53 C16.2
USB_SSTX_DN1_P  (via drill 0.25)
  Top 0.203: U2.55 34.54,25.69 34.48,25.63 30.61,25.63 v30.61,25.76
  Bottom 0.203: v30.61,25.76 30.61,25.63 28.19,25.63 26.89,24.33 26.89,14.93 25.01,13.06 18.73,13.06 18.54,13.25 C17.2
USB_SSTX_DN2_N  (via drill 0.25)
  Top 0.203: U2.15 49.43,30.19 49.53,30.09 52.35,30.09 v52.35,30.21
  Bottom 0.203: v52.35,30.21 52.35,30.09 55.86,30.09 60.74,34.96 64.47,34.96 64.62,35.12 C18.2
USB_SSTX_DN2_P  (via drill 0.25)
  Top 0.203: U2.14 49.46,29.69 49.53,29.76 52.35,29.76 v52.35,29.63
  Bottom 0.203: v52.35,29.63 52.35,29.76 56,29.76 60.88,34.63 64.47,34.63 64.62,34.48 C19.2
USB_SSTX_DN3_N  (via drill 0.25)
  Top 0.203: U2.50 34.64,28.19 34.54,28.28 33.78,28.28 v33.78,28.16
  Bottom 0.203: v33.78,28.16 33.78,28.28 33.33,28.28 31.97,29.65 31.97,39.56 29.08,42.44 18.73,42.44 18.54,42.25 C37.2
USB_SSTX_DN3_P  (via drill 0.25)
  Top 0.203: U2.49 34.62,28.69 34.54,28.61 33.78,28.61 v33.78,28.74
  Bottom 0.203: v33.78,28.74 33.78,28.61 33.47,28.61 32.3,29.79 32.3,39.69 29.21,42.77 18.73,42.77 18.54,42.97 C38.2
VDD11  (32 unrouted)
VDD33  (22 unrouted)

### Text on the board
tPlace: SS SUS | HS SUS | SS\ | HS | EXT Power | P1 | P2 | P3 | P4